# Altium schematic sheet [04] - CPU IO.SchDoc: DOCUMENT TITLE
size A3; Organization: Bjørn T. Brodtkorb; Address1: Frode Rinnans veg 161; Address2: 7050 Trondheim; DocumentNumber: 6598; Revision: 1.0; SheetNumber: 1; SheetTotal: 1
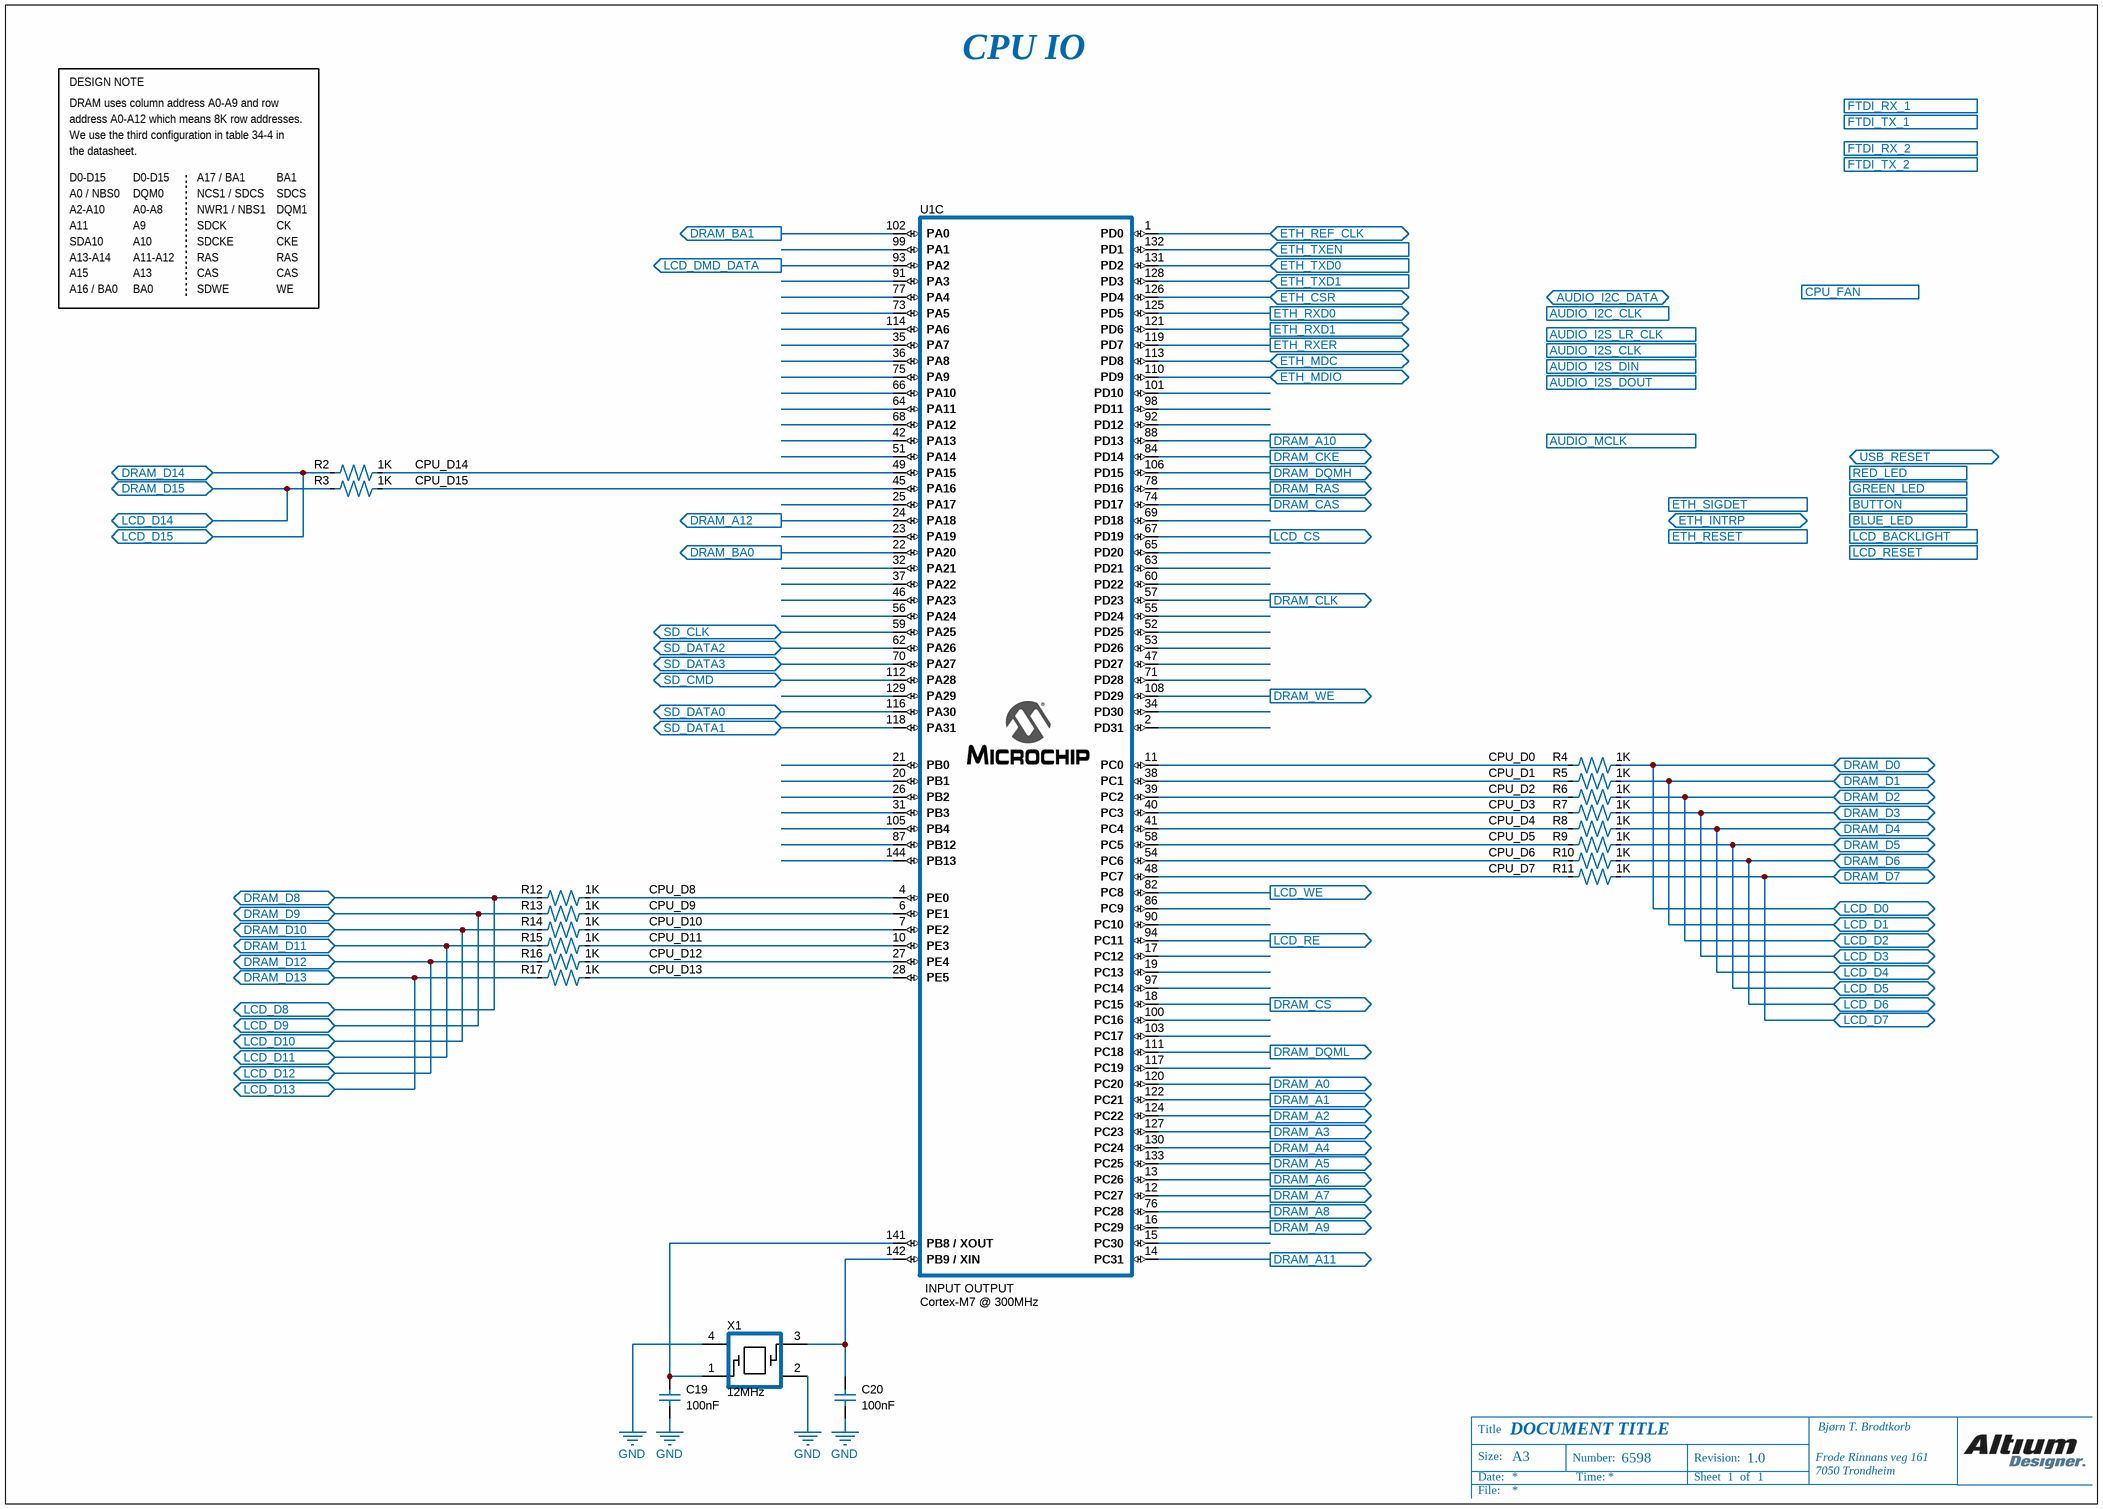
[diagram p0: [04] - CPU IO.SchDoc]

## Parts
C19  value 100nF  [C0402]  (hidden comment: 04023C103KAT2A)
C20  value 100nF  [C0402]  (hidden comment: 04023C103KAT2A)
R2  value 1K  [R0402]  (hidden comment: CRCW04020000Z0ED)
R3  value 1K  [R0402]  (hidden comment: CRCW04020000Z0ED)
R4  value 1K  [R0402]  (hidden comment: CRCW04020000Z0ED)
R5  value 1K  [R0402]  (hidden comment: CRCW04020000Z0ED)
R6  value 1K  [R0402]  (hidden comment: CRCW04020000Z0ED)
R7  value 1K  [R0402]  (hidden comment: CRCW04020000Z0ED)
R8  value 1K  [R0402]  (hidden comment: CRCW04020000Z0ED)
R9  value 1K  [R0402]  (hidden comment: CRCW04020000Z0ED)
R10  value 1K  [R0402]  (hidden comment: CRCW04020000Z0ED)
R11  value 1K  [R0402]  (hidden comment: CRCW04020000Z0ED)
R12  value 1K  [R0402]  (hidden comment: CRCW04020000Z0ED)
R13  value 1K  [R0402]  (hidden comment: CRCW04020000Z0ED)
R14  value 1K  [R0402]  (hidden comment: CRCW04020000Z0ED)
R15  value 1K  [R0402]  (hidden comment: CRCW04020000Z0ED)
R16  value 1K  [R0402]  (hidden comment: CRCW04020000Z0ED)
R17  value 1K  [R0402]  (hidden comment: CRCW04020000Z0ED)
U1  Cortex-M7 @ 300MHz  [ATSAMS70Q21A-AN]  (part C of 3)
X1  12MHz  [MCSJK-7U-12.00-12-30-80-B-30]

## Ports
AUDIO_I2C_CLK (in), AUDIO_I2C_DATA (bidir), AUDIO_I2S_CLK (in), AUDIO_I2S_DIN (in), AUDIO_I2S_DOUT (out), AUDIO_I2S_LR_CLK (in), AUDIO_MCLK (in), BLUE_LED (out), BUTTON (out), CPU_FAN (in), DRAM_A0 (out), DRAM_A1 (out), DRAM_A2 (out), DRAM_A3 (out), DRAM_A4 (out), DRAM_A5 (out), DRAM_A6 (out), DRAM_A7 (out), DRAM_A8 (out), DRAM_A9 (out), DRAM_A10 (out), DRAM_A11 (out), DRAM_A12 (out), DRAM_BA0 (out), DRAM_BA1 (out), DRAM_CAS (out), DRAM_CKE (out), DRAM_CLK (out), DRAM_CS (out), DRAM_D0 (bidir), DRAM_D1 (bidir), DRAM_D2 (bidir), DRAM_D3 (bidir), DRAM_D4 (bidir), DRAM_D5 (bidir), DRAM_D6 (bidir), DRAM_D7 (bidir), DRAM_D8 (bidir), DRAM_D9 (bidir), DRAM_D10 (bidir), DRAM_D11 (bidir), DRAM_D12 (bidir), DRAM_D13 (bidir), DRAM_D14 (bidir), DRAM_D15 (bidir), DRAM_DQMH (out), DRAM_DQML (out), DRAM_RAS (out), DRAM_WE (out), ETH_CSR (bidir), ETH_INTRP (bidir), ETH_MDC (bidir), ETH_MDIO (bidir), ETH_REF_CLK (bidir), ETH_RESET (in), ETH_RXD0 (out), ETH_RXD1 (out), ETH_RXER (out), ETH_SIGDET (in), ETH_TXD0 (in), ETH_TXD1 (in), ETH_TXEN (in), FTDI_RX_1 (out), FTDI_RX_2 (out), FTDI_TX_1 (in), FTDI_TX_2 (in), GREEN_LED (out), LCD_BACKLIGHT (in), LCD_CS (out), LCD_D0 (bidir), LCD_D1 (bidir), LCD_D2 (bidir), LCD_D3 (bidir), LCD_D4 (bidir), LCD_D5 (bidir), LCD_D6 (bidir), LCD_D7 (bidir), LCD_D8 (bidir), LCD_D9 (bidir), LCD_D10 (bidir), LCD_D11 (bidir), LCD_D12 (bidir), LCD_D13 (bidir), LCD_D14 (bidir), LCD_D15 (bidir), LCD_DMD_DATA (out), LCD_RE (out), LCD_RESET (in), LCD_WE (out), RED_LED (out), SD_CLK (bidir), SD_CMD (bidir), SD_DATA0 (bidir), SD_DATA1 (bidir), SD_DATA2 (bidir), SD_DATA3 (bidir), USB_RESET (bidir)

## Nets
GND: C19.1 C20.1 X1.2 X1.4
CPU_D0: R4.2 U1.11(PC0)
CPU_D1: R5.2 U1.38(PC1)
CPU_D2: R6.2 U1.39(PC2)
CPU_D3: R7.2 U1.40(PC3)
CPU_D4: R8.2 U1.41(PC4)
CPU_D5: R9.2 U1.58(PC5)
CPU_D6: R10.2 U1.54(PC6)
CPU_D7: R11.2 U1.48(PC7)
CPU_D8: R12.1 U1.4(PE0)
CPU_D9: R13.1 U1.6(PE1)
CPU_D10: R14.1 U1.7(PE2)
CPU_D11: R15.1 U1.10(PE3)
CPU_D12: R16.1 U1.27(PE4)
CPU_D13: R17.1 U1.28(PE5)
CPU_D14: R2.1 U1.49(PA15)
CPU_D15: R3.1 U1.45(PA16)
DRAM_A0: U1.120(PC20) ; port DRAM_A0
DRAM_A1: U1.122(PC21) ; port DRAM_A1
DRAM_A2: U1.124(PC22) ; port DRAM_A2
DRAM_A3: U1.127(PC23) ; port DRAM_A3
DRAM_A4: U1.130(PC24) ; port DRAM_A4
DRAM_A5: U1.133(PC25) ; port DRAM_A5
DRAM_A6: U1.13(PC26) ; port DRAM_A6
DRAM_A7: U1.12(PC27) ; port DRAM_A7
DRAM_A8: U1.76(PC28) ; port DRAM_A8
DRAM_A9: U1.16(PC29) ; port DRAM_A9
DRAM_A10: U1.88(PD13) ; port DRAM_A10
DRAM_A11: U1.14(PC31) ; port DRAM_A11
DRAM_A12: U1.24(PA18) ; port DRAM_A12
DRAM_BA0: U1.22(PA20) ; port DRAM_BA0
DRAM_BA1: U1.102(PA0) ; port DRAM_BA1
DRAM_CAS: U1.74(PD17) ; port DRAM_CAS
DRAM_CKE: U1.84(PD14) ; port DRAM_CKE
DRAM_CLK: U1.57(PD23) ; port DRAM_CLK
DRAM_CS: U1.18(PC15) ; port DRAM_CS
DRAM_D0: R4.1 ; port DRAM_D0, port LCD_D0
DRAM_D1: R5.1 ; port DRAM_D1, port LCD_D1
DRAM_D2: R6.1 ; port DRAM_D2, port LCD_D2
DRAM_D3: R7.1 ; port DRAM_D3, port LCD_D3
DRAM_D4: R8.1 ; port DRAM_D4, port LCD_D4
DRAM_D5: R9.1 ; port DRAM_D5, port LCD_D5
DRAM_D6: R10.1 ; port DRAM_D6, port LCD_D6
DRAM_D7: R11.1 ; port DRAM_D7, port LCD_D7
DRAM_D8: R12.2 ; port DRAM_D8, port LCD_D8
DRAM_D9: R13.2 ; port DRAM_D9, port LCD_D9
DRAM_D10: R14.2 ; port DRAM_D10, port LCD_D10
DRAM_D11: R15.2 ; port DRAM_D11, port LCD_D11
DRAM_D12: R16.2 ; port DRAM_D12, port LCD_D12
DRAM_D13: R17.2 ; port DRAM_D13, port LCD_D13
DRAM_D14: R2.2 ; port DRAM_D14, port LCD_D15
DRAM_D15: R3.2 ; port DRAM_D15, port LCD_D14
DRAM_DQMH: U1.106(PD15) ; port DRAM_DQMH
DRAM_DQML: U1.111(PC18) ; port DRAM_DQML
DRAM_RAS: U1.78(PD16) ; port DRAM_RAS
DRAM_WE: U1.108(PD29) ; port DRAM_WE
ETH_CSR: U1.126(PD4) ; port ETH_CSR
ETH_MDC: U1.113(PD8) ; port ETH_MDC
ETH_MDIO: U1.110(PD9) ; port ETH_MDIO
ETH_REF_CLK: U1.1(PD0) ; port ETH_REF_CLK
ETH_RXD0: U1.125(PD5) ; port ETH_RXD0
ETH_RXD1: U1.121(PD6) ; port ETH_RXD1
ETH_RXER: U1.119(PD7) ; port ETH_RXER
ETH_TXD0: U1.131(PD2) ; port ETH_TXD0
ETH_TXD1: U1.128(PD3) ; port ETH_TXD1
ETH_TXEN: U1.132(PD1) ; port ETH_TXEN
LCD_CS: U1.67(PD19) ; port LCD_CS
LCD_DMD_DATA: U1.93(PA2) ; port LCD_DMD_DATA
LCD_RE: U1.94(PC11) ; port LCD_RE
LCD_WE: U1.82(PC8) ; port LCD_WE
SD_CLK: U1.59(PA25) ; port SD_CLK
SD_CMD: U1.112(PA28) ; port SD_CMD
SD_DATA0: U1.116(PA30) ; port SD_DATA0
SD_DATA1: U1.118(PA31) ; port SD_DATA1
SD_DATA2: U1.62(PA26) ; port SD_DATA2
SD_DATA3: U1.70(PA27) ; port SD_DATA3
NetC19_2: C19.2 U1.141(PB8_/_XOUT) X1.1
NetC20_2: C20.2 U1.142(PB9_/_XIN) X1.3

Not connected (* = marked no-connect by the designer): U1 2(PD31) 15(PC30) 17(PC12) 19(PC13) 20(PB1) 21(PB0) 23(PA19) 25(PA17) 26(PB2) 31(PB3) 32(PA21) 34(PD30) 35(PA7) 36(PA8) 37(PA22) 42(PA13) 46(PA23) 47(PD27) 51(PA14) 52(PD25) 53(PD26) 55(PD24) 56(PA24) 60(PD22) 63(PD21) 64(PA11) 65(PD20) 66(PA10) 68(PA12) 69(PD18) 71(PD28) 73(PA5) 75(PA9) 77(PA4) 86(PC9) 87(PB12) 90(PC10) 91(PA3) 92(PD12) 97(PC14) 98(PD11) 99(PA1) 100(PC16) 101(PD10) 103(PC17) 105(PB4) 114(PA6) 117(PC19) 129(PA29) 144(PB13)

## Notes on the sheet
- DESIGN NOTE
- DRAM uses column address A0-A9 and row
- CPU IO
- address A0-A12 which means 8K row addresses.
- We use the third configuration in table 34-4 in
- the datasheet.
- D0-D15
- A17 / BA1
- BA1
- A0 / NBS0
- A2-A10
- A11
- SDA10
- DQM0
- A0-A8
- A9
- A10
- NCS1 / SDCS
- NWR1 / NBS1
- SDCK
- SDCKE
- SDCS
- DQM1
- CK
- CKE
- A13-A14
- A15
- A16 / BA0
- A11-A12
- A13
- BA0
- RAS
- CAS
- SDWE
- WE
- Title
- Size:
- A3
- Number:
- Revision:
- Date:
- File:
- Time:
- Sheet
- of
- (in symbol ATSAMS70Q21A-AN, part C) INPUT OUTPUT

## Library data of the parts
C19 C20 = 04023C103KAT2A: C0402
R2-R17 = CRCW04020000Z0ED: R0402
U1 = ATSAMS70Q21A-AN: ATSAMS70Q21; Supplier Part Number 1: 2484397; Supplier 1: Farnell
X1 = MCSJK-7U-12.00-12-30-80-B-30: Crystal 12MHz 3.2mm x 2.5mm; Supplier Part Number 1: 2853917; Supplier 1: Farnell